# EAGLE design trackuino-shield (EAGLE 9.2.2)
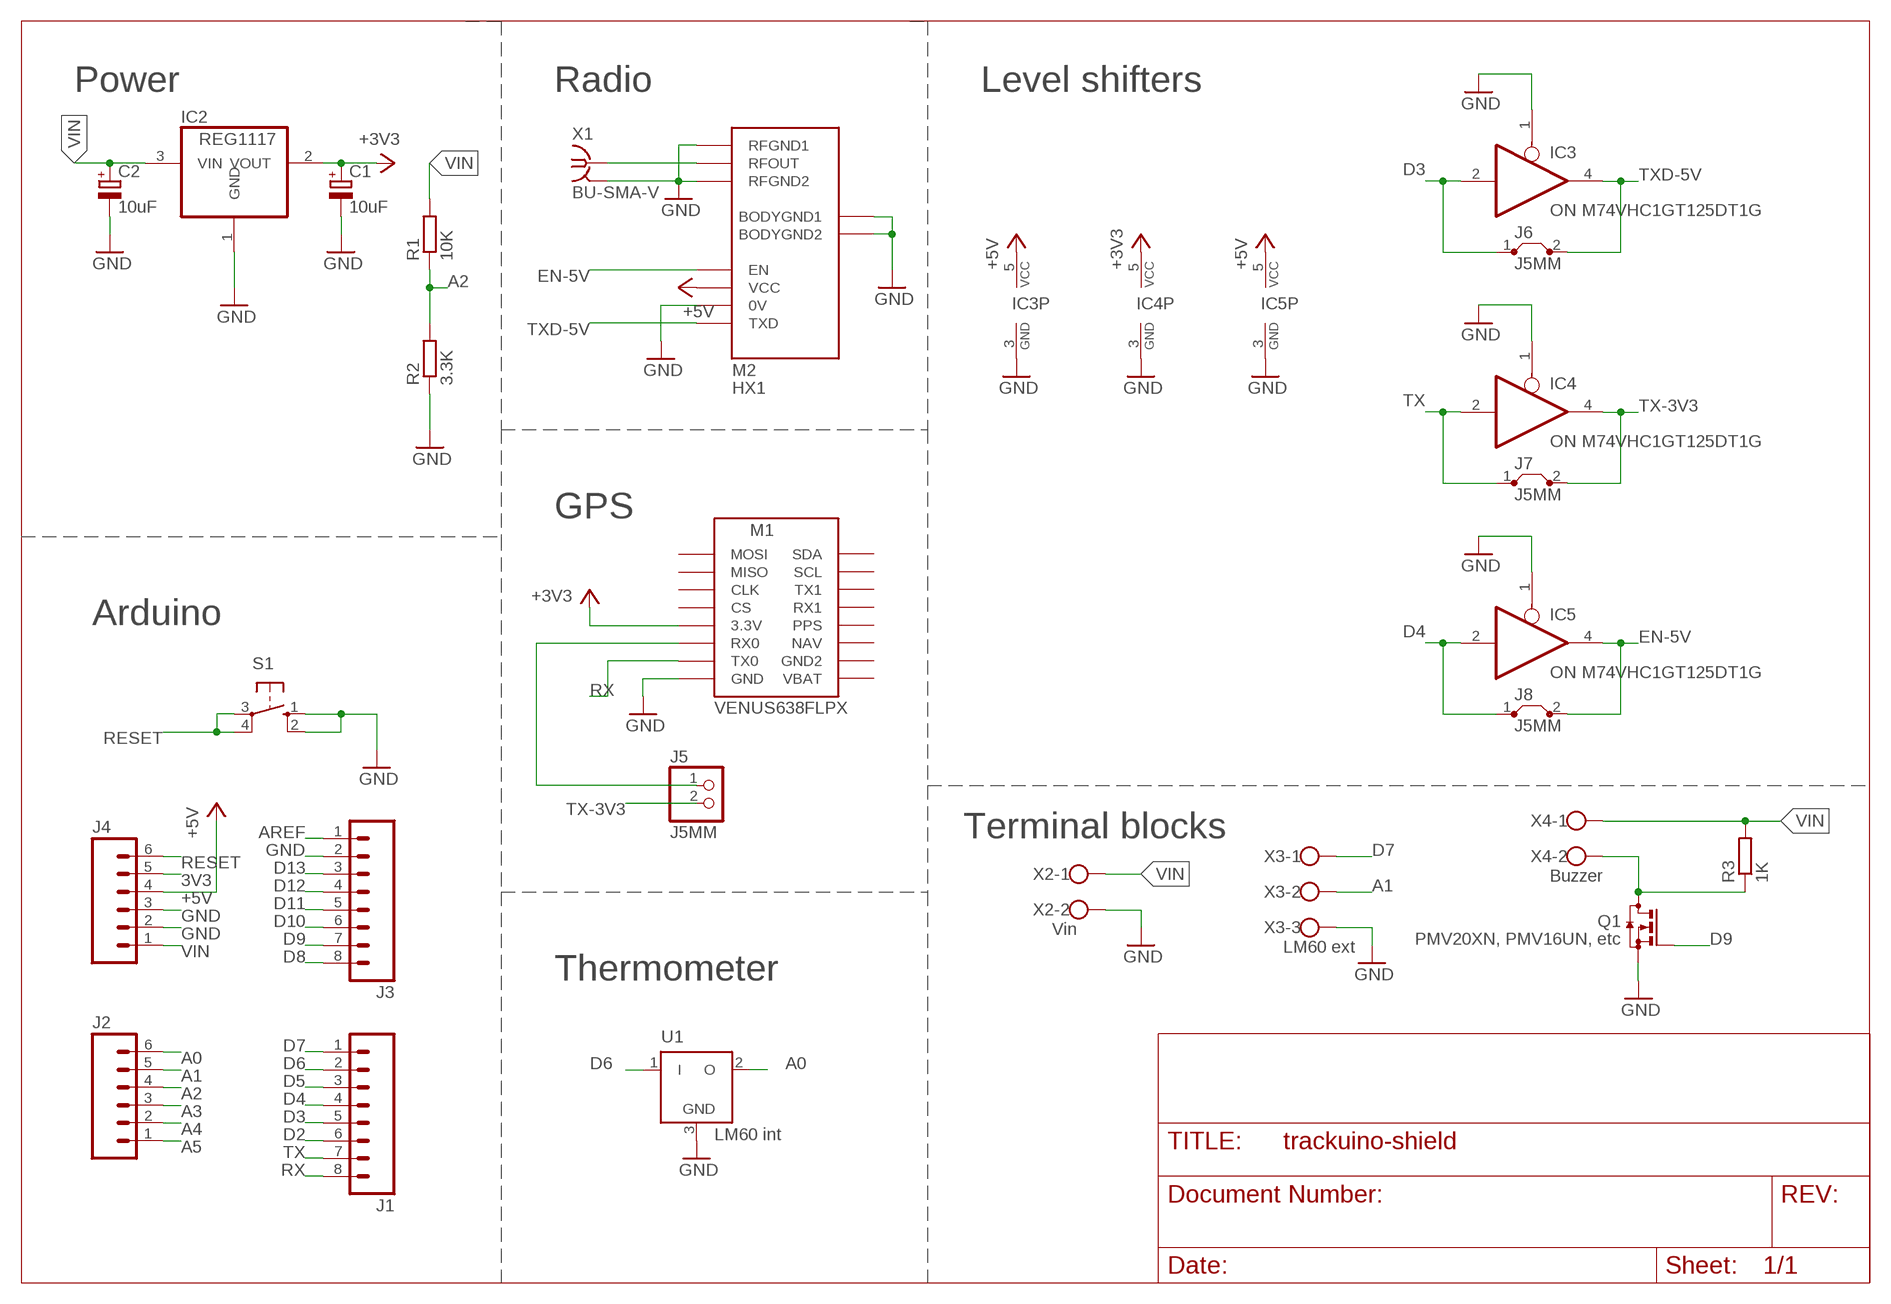
[diagram p0: schematic, sheet 1]

## Parts
C1  10uF  CPOL-EUE2.5-5  [E2,5-5]
C2  10uF  CPOL-EUE2.5-5  [E2,5-5]
IC2  REG1117  [SOT223]
IC3  ON M74VHC1GT125DT1G  74AHC1G125DBV  [SOT23-5]
IC4  ON M74VHC1GT125DT1G  74AHC1G125DBV  [SOT23-5]
IC5  ON M74VHC1GT125DT1G  74AHC1G125DBV  [SOT23-5]
J1  M08LOCK  [1X08_LOCK]
J2  M06FEMALE_LOCK  [1X06_FEMALE_LOCK.010]
J3  M08LOCK  [1X08_LOCK]
J4  M06FEMALE_LOCK  [1X06_FEMALE_LOCK.010]
J5  J5MM  PINHD-1X2  [1X02]
J6  J5MM  [05]
J7  J5MM  [05]
J8  J5MM  [05]
M1  VENUS638FLPX  [VENUS638FLPX]
M2  HX1  [HX1]
Q1  PMV20XN, PMV16UN, etc  BSS123  [SOT23]
R1  10K  R-EU_R1206  [R1206]
R2  3.3K  R-EU_R1206  [R1206]
R3  1K  R-EU_R1206  [R1206]
S1  10-XX  [B3F-10XX]
U1  LM60 int  LM60  [TO92]
X1  BU-SMA-V  [BU-SMA-V]
X2  Vin  W237-102  [W237-102]
X3  LM60 ext  W237-103  [W237-103]
X4  Buzzer  W237-102  [W237-102]

## Nets
3V3: J4.5
+3V3 [20]: C1.+ IC2.2(VOUT) IC4.5(VCC) M1.3V3(3.3V)
+5V [20]: IC3.5(VCC) IC5.5(VCC) J4.4 M2.VCC
A0: J2.6 U1.2(O)
A1: J2.5 X3.2
A2: J2.4 R1.1 R2.2
A3: J2.3
A4: J2.2
A5: J2.1
AREF: J3.1
D2: J1.6
D3: IC3.2(I) J1.5 J6.1
D4: IC5.2(I) J1.4 J8.1
D5: J1.3
D6: J1.2 U1.1(I)
D7: J1.1 X3.1
D8: J3.8
D9: J3.7 Q1.1(G)
D10: J3.6
D11: J3.5
D12: J3.4
D13: J3.3
EN-5V: IC5.4(O) J8.2 M2.EN
GND: C1.- C2.- IC2.1(GND) IC3.1(OE) IC3.3(GND) IC4.1(OE) IC4.3(GND) IC5.1(OE) IC5.3(GND) J3.2 J4.2 J4.3 M1.GND M2.0V M2.BODYGND1 M2.BODYGND2 M2.RFGND1 M2.RFGND2 Q1.2(S) R2.1 S1.1(S) S1.2(S1) U1.3(GND) X1.2(GND) X2.2 X3.3
N$1: Q1.3(D) R3.1 X4.2
N$2: J5.1 M1.RX0
RESET: J4.6 S1.3(P) S1.4(P1)
RFOUT [20]: M2.RFOUT X1.1
RX: J1.8 M1.TX0
TX: IC4.2(I) J1.7 J7.1
TX-3V3: IC4.4(O) J5.2 J7.2
TXD-5V: IC3.4(O) J6.2 M2.TXD
VIN [30]: C2.+ IC2.3(VIN) J4.1 R1.2 R3.2 X2.1 X4.1
Unconnected: M1.CLK M1.CS M1.GND2 M1.MISO M1.MOSI M1.NAV M1.PPS M1.RX1 M1.SCL M1.SDA M1.TX1 M1.VBAT

## Notes on the sheet
- Power | Radio | Level shifters
- GPS
- Arduino
- Terminal blocks
- Thermometer

## Power pins joined to a net without a drawn wire
GND: X1.3(GND) X1.4(GND) X1.5(GND)

## Library data of the parts
C1 C2 = rcl:CPOL-EU: POLARIZED CAPACITOR, European symbol
IC2 = burr-brown:REG1117: 800mA and 1A Low Dropout (LDO) Positive Regulator 1.8V, 2.5V, 2.85V, 3.3V, 5V, and Adj; MPN: REG1117; OC_FARNELL: 1097566; OC_NEWARK: 14P6981
IC3-IC5 = 74xx-little-us:74*1G125: Single Bus Buffer Gate with 3-State Output
J1 J3 = SparkFun:M08: Header 8 Standard 8-pin 0.1" header. Use with straight break away headers (SKU : PRT-00116), right angle break away headers (PRT-00553), swiss pins (PRT-00743), machine pins (PRT-00117), and female headers (PRT-00115).
J2 J4 = SparkFun:M06: Header 6 Standard 6-pin 0.1" header. Use with straight break away headers (SKU : PRT-00116), right angle break away headers (PRT-00553), swiss pins (PRT-00743), machine pins (PRT-00117), and female headers (PRT-00115). Molex polarized connector foot print use with SKU : PRT-08094 with associated crimp pins and housings. NOTES ON THE VARIANTS LOCK and LOCK_LONGPADS... This footprint was designed to help hold the alignment of a through-hole component (i.e. 6-pin header) while soldering it into place. You may notice that each hole has been shifted either up or down by 0.005 of an inch from it's more standard position (which is a perfectly straight line). This slight alteration caused the pins (the squares in the middle) to touch the edges of the holes. Because they are alternating, it causes a "brace" to hold the component in place. 0.005 has proven to be the perfect amount of "off-center" position when using our standard breakaway headers. Although looks a little odd when you look at the bare footprint, once you have a header in there, the alteration is very hard to notice. Also, if you push a header all the way into place, it is covered up entirely on the bottom side. This idea of altering the position of holes to aid alignment will be further integrated into the Sparkfun Library for other footprints. It can help hold any component with 3 or more connection pins.
J5 = pinhead:PINHD-1X2: PIN HEADER
J6-J8 = jumper:J: Bridge
M1 = Venus638FLPx:VENUS638FLPX
M2 = trackuino:HX1
Q1 = transistor-small-signal:BSS123: N-CHANNEL MOS FET
R1-R3 = resistor:R-EU_: RESISTOR, European symbol
S1 = switch-omron:10-XX: OMRON SWITCH
U1 = trackuino:LM60
X1 = con-coax:BU-SMA-V: FEMALE SMA CONNECTOR Radiall distributor RS 112-3794; OC_FARNELL: unknown; OC_NEWARK: unknown
X2 X4 = con-wago-500:W237-102: WAGO SCREW CLAMP; MPN: 237-102; OC_FARNELL: unknown; OC_NEWARK: 70K9898
X3 = con-wago-500:W237-103: WAGO SCREW CLAMP; MPN: 237-103; OC_FARNELL: unknown; OC_NEWARK: 18M7116

## Net classes
0 10: width 0.254 mm
1 15: width 0.381 mm
2 20: width 0.508 mm
3 30: width 0.762 mm
4 40: width 1.016 mm
5 50: width 1.27 mm
6 HIGH Current: width 2.54 mm

## Board
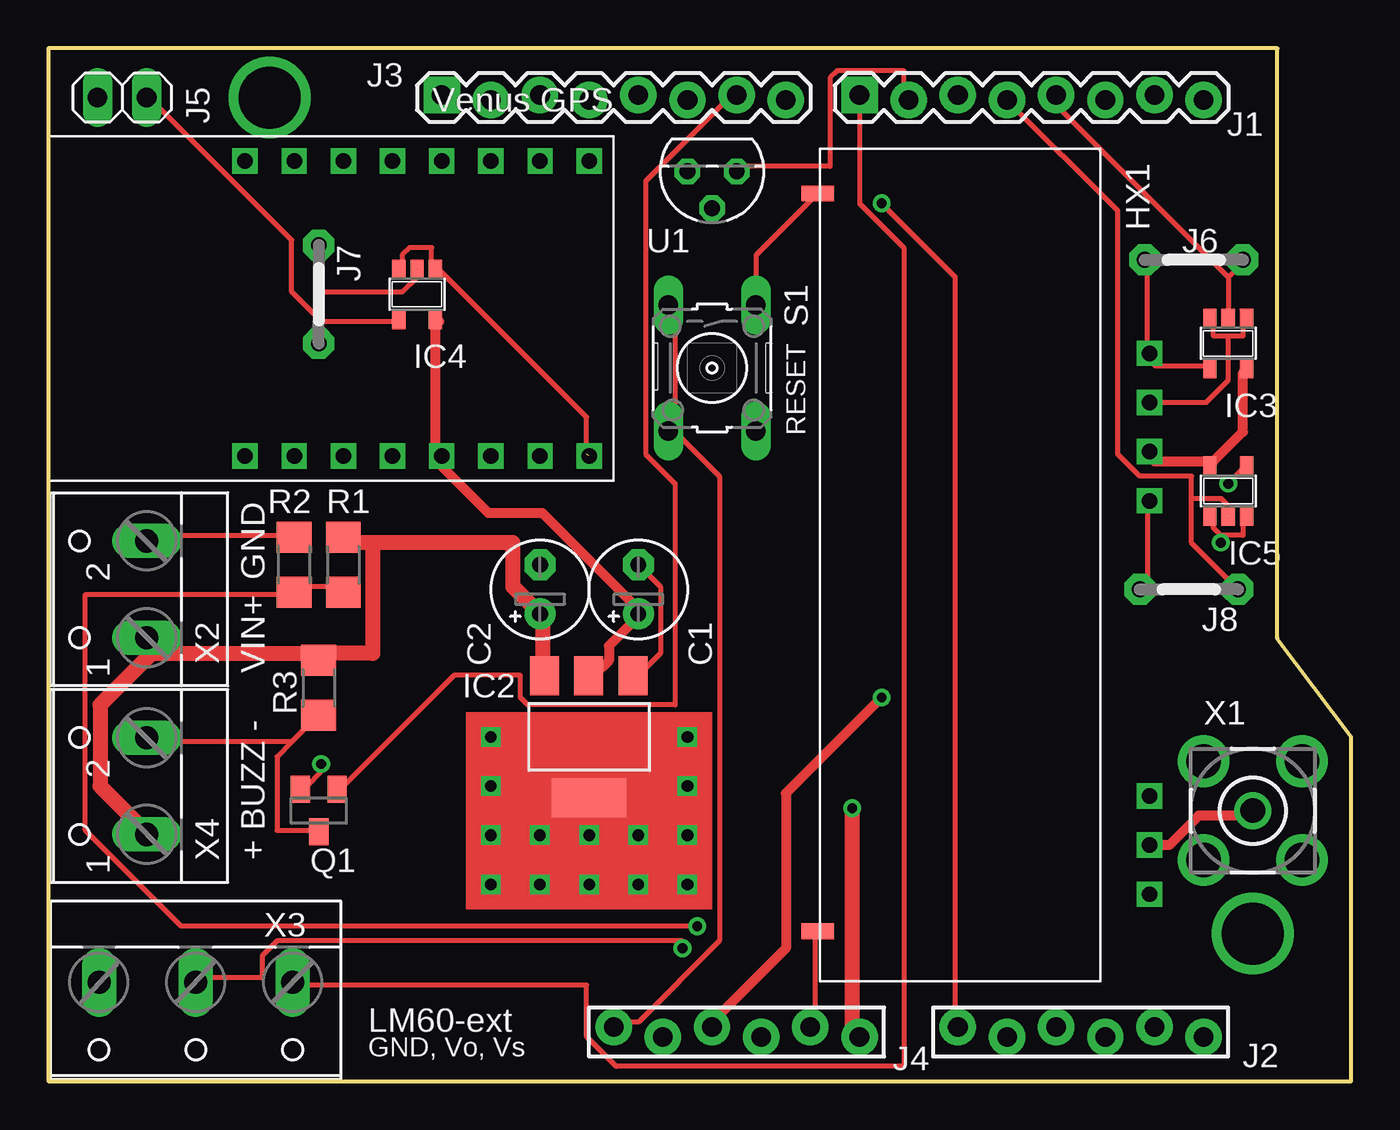
[diagram p1: board, top side]
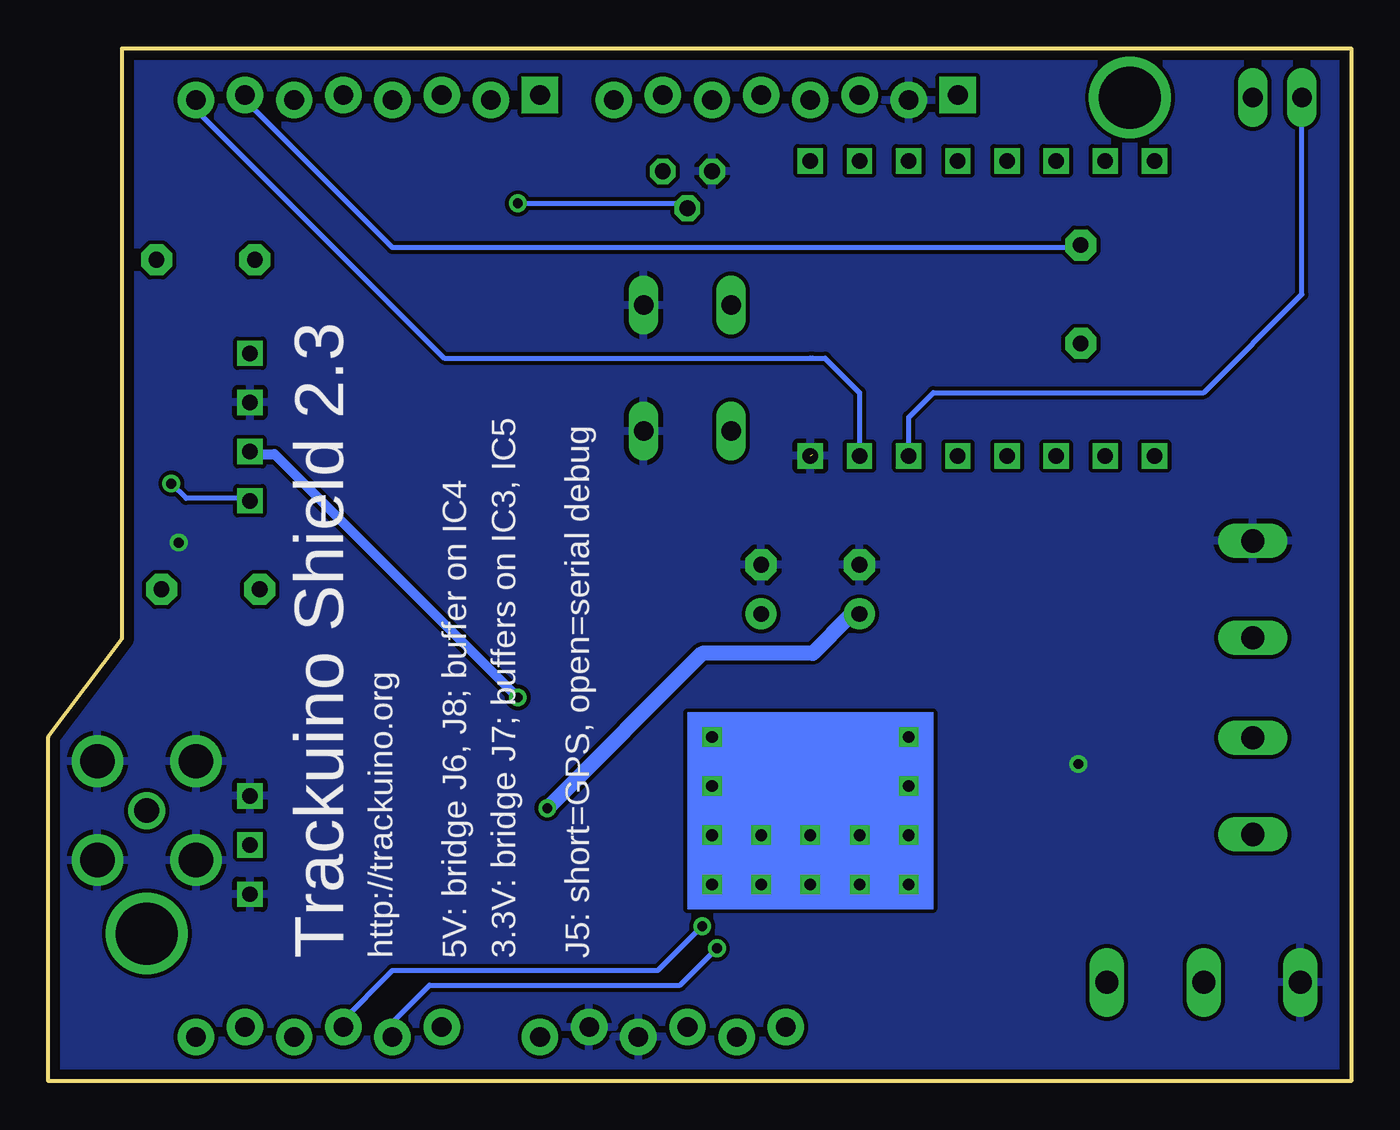
[diagram p2: board, bottom side, seen from below]

Size 67.31 x 53.34 mm. Coordinates in mm from the lower left corner, seen from the top.
Outline: 63.5,53.34 0,53.34 0,0 67.31,0 67.31,17.78 63.5,22.86 63.5,53.34
Copper layers (1*16): Top 0.035mm / dielectric 1.5mm / Bottom 0.035mm
Design rules "default": minimum track width 10mil, minimum drill 20mil, track to track 8mil, track to pad 8mil, pad to pad 8mil, via to via 8mil, smd to smd 8mil, copper to edge 20mil, drill to drill 8mil, minimum pad ring 10mil, minimum via ring 8mil, stop-mask expansion 4mil, vias tented up to drill 0mil, thermal gap 10mil

### Footprints (pad centres in the part's own frame; a part is rotated, then mirrored left to right if it is on the bottom)
E2,5-5 = drill 0.813 pad 1.6: + -1.27,0 | drill 0.813 pad 1.6 octagon: - 1.27,0
SOT223 = smd 1.499 x 2.007: 1 -2.261,-3.15; 2 0.025,-3.15; 3 2.311,-3.15 | smd 3.81 x 2.007: 4 0,3.15
SOT23-5 = smd 0.69 x 0.99: 1 -0.95,-1.29; 2 0,-1.29; 3 0.95,-1.29; 4 0.95,1.3; 5 -0.95,1.3
1X08_LOCK = drill 1.016 pad 1.88 square: 1 0,0.127 | drill 1.016 pad 1.88: 2 2.54,-0.127; 3 5.08,0.127; 4 7.62,-0.127; 5 10.16,0.127; 6 12.7,-0.127; 7 15.24,0.127; 8 17.78,-0.127
1X06_FEMALE_LOCK.010 = drill 1.016 pad 1.88: 1 0,0.254; 2 2.54,-0.254; 3 5.08,0.254; 4 7.62,-0.254; 5 10.16,0.254; 6 12.7,-0.254
1X02 = drill 1.016 long: 1 -1.27,0; 2 1.27,0
05 = drill 0.813 pad 1.6 octagon: 1 -2.54,0; 2 2.54,0
VENUS638FLPX = drill 0.8 square: 3V3 8.89,16.51; CLK 13.97,16.51; CS 11.43,16.51; GND 1.27,16.51; GND2 3.81,1.27; MISO 16.51,16.51; MOSI 19.05,16.51; NAV 6.35,1.27; PPS 8.89,1.27; RX0 6.35,16.51; RX1 11.43,1.27; SCL 16.51,1.27; SDA 19.05,1.27; TX0 3.81,16.51; TX1 13.97,1.27; VBAT 1.27,1.27
HX1 = drill 0.8 square: 0V 25.4,-8.89; EN 20.32,-8.89; RFGND1 0,-8.89; RFGND2 5.08,-8.89; RFOUT 2.54,-8.89; TXD 27.94,-8.89; VCC 22.86,-8.89 | smd 0.813 x 1.676: BODYGND1 -1.905,8.255; BODYGND2 36.195,8.255
SOT23 = smd 1 x 1.4: 1 -0.95,-1.1; 2 0.95,-1.1; 3 0,1.1
R1206 = smd 1.6 x 1.803: 1 -1.422,0; 2 1.422,0
B3F-10XX = drill 1.016 long: 1 -3.251,2.261; 2 3.251,2.261; 3 -3.251,-2.261; 4 3.251,-2.261
TO92 = drill 0.813 octagon: 1 -1.27,0; 2 0,1.905; 3 1.27,0
BU-SMA-V = drill 1.27: 1 0,0 | drill 1.778: 2 -2.55,2.55; 3 2.55,2.55; 4 2.55,-2.55; 5 -2.55,-2.55
W237-102 = drill 1.194 long: 1 -2.5,-1.27; 2 2.5,-1.27
W237-103 = drill 1.194 long: 1 -5,-1.29; 2 0,-1.29; 3 5,-1.29

### Placement (x,y rotation side)
C1  30.48,25.4 90 top
C2  25.4,25.4 90 top
IC2  27.94,17.78 180 top
IC3  60.96,38.1 180 top
IC4  19.05,40.64 180 top
IC5  60.96,30.48 0 top
J1  41.91,50.8 0 top
J2  59.69,2.54 180 top
J3  20.32,50.8 0 top
J4  41.91,2.54 180 top
J5  3.81,50.8 0 top
J6  59.18,42.42 180 top
J7  13.97,40.64 270 top
J8  58.93,25.4 180 top
M1  29.21,48.8 180 top
M2  48.01,9.65 90 top
Q1  13.97,13.97 180 top
R1  15.24,26.67 90 top
R2  12.7,26.67 270 top
R3  13.97,20.32 90 top
S1  34.29,36.83 270 top
U1  34.29,46.99 180 top
X1  62.23,13.97 0 top
X2  3.81,25.4 90 top
X3  7.62,3.81 180 top
X4  3.81,15.24 90 top

### Tracks (layer width: path | path; a pad name or v marks a point on that pad's centre or on a via)
+3V3
  Top 0.508: IC2.2 28.19,20.95 28.96,21.72 28.96,22.48 30.48,24 C1.+ 30.48,24.38 25.53,29.34 22.73,29.34 20.32,31.75 M1.3V3 20,32.61 IC4.5 20.19,39.24
+5V  (via drill 0.51)
  Top 0.508: M2.VCC 57.15,32.38 57.15,32 59.82,32 IC5.5 60.2,32 61.72,33.53 61.72,36.58 IC3.5 | v43.05,19.81 38.1,14.86 38.1,6.86 34.29,3.05 J4.4
  Bottom 0.508: v43.05,19.81 55.63,32.38 56.77,32.38 M2.VCC
A0  (via drill 0.51)
  Top 0.254: v43.05,45.34 46.86,41.53 46.86,3.05 J2.6
  Bottom 0.254: v43.05,45.34 34.29,45.34 U1.2
A1  (via drill 0.51)
  Top 0.254: v32.77,6.86 32.77,7.24 11.81,7.24 11.05,6.48 11.05,5.33 7.62,5.33 X3.2
  Bottom 0.254: v32.77,6.86 34.67,4.95 47.62,4.95 49.53,3.05 J2.5
A2  (via drill 0.51)
  Top 0.254: R1.1 15.24,25.53 12.95,25.53 R2.2 12.57,25.15 1.91,25.15 1.91,12.95 6.86,8 v33.53,8
  Bottom 0.254: v33.53,8 35.81,5.71 49.53,5.71 52.2,3.05 J2.4
D3
  Top 0.254: 60.96,41.53 IC3.2 | 60.96,41.53 61.72,42.29 J6.1 | 60.96,41.53 52.2,50.29 52.2,50.67 J1.5
D4
  Top 0.254: IC5.2 60.96,29.72 60.58,30.1 59.05,30.1 | 59.05,30.1 59.05,27.81 J8.1 | J1.4 55.24,44.96 55.24,32.38 56.39,31.24 59.05,31.24 59.05,30.1
D6
  Top 0.254: U1.1 35.81,47.24 40.39,47.24 40.39,51.82 40.77,52.2 44.2,52.2 44.2,50.67 J1.2
D7
  Top 0.254: J1.1 41.91,45.34 44.2,43.05 44.2,0.76 29.34,0.76 27.81,2.29 27.81,4.95 12.95,4.95 X3.1
D9
  Top 0.254: Q1.1 15.24,15.24 20.95,20.95 24.38,20.95 24.38,19.81 24.77,19.43 32.38,19.43 32.38,30.86 30.86,32.38 30.86,46.48 35.43,51.05 J3.7
EN-5V  (via drill 0.51)
  Top 0.254: v60.96,30.86 61.72,31.62 IC5.4 | J8.2 56.39,25.53 56.77,25.91 56.77,29.72 M2.EN
  Bottom 0.254: v60.96,30.86 60.2,30.1 57.15,30.1 M2.EN
GND  (via drill 0.51)  (1 unrouted)
  Top 0.254: IC4.3 18.29,42.29 18.29,42.67 18.67,43.05 19.81,43.05 19.81,42.29 IC4.1 20.19,41.91 27.81,34.29 27.81,32.38 | 60.58,28.19 60.2,28.57 60.2,28.96 IC5.1 | 60.58,28.19 61.72,28.19 61.72,28.96 IC5.3 | 60.96,38.48 61.72,38.48 61.72,39.24 IC3.1 | 60.96,38.48 60.2,38.48 60.2,39.24 IC3.3 | v14.1,16.38 14.1,16 13.34,15.24 Q1.2 | M2.BODYGND1 39.62,7.62 39.62,3.05 J4.2 | M2.BODYGND2 36.58,42.67 36.58,40.39 S1.1 | 60.96,38.48 60.96,36.2 59.82,35.05 M2.0V | v60.58,27.81 60.58,28.19 | R2.1 12.57,28.19 5.33,28.19 X2.2 | C1.- 31.62,25.53 31.62,22.1 30.48,20.95 IC2.1
  pour Bottom: 0,53.34 63.5,53.34 63.5,22.86 67.31,17.78 67.31,0 0,0
N$1
  Top 0.254: 12.57,17.53 13.72,18.67 R3.1 | 12.57,17.53 11.81,16.76 11.81,12.95 13.72,12.95 Q1.3 | 12.57,17.53 5.33,17.53 X4.2
N$2
  Bottom 0.254: M1.RX0 22.86,34.29 21.59,35.56 7.62,35.56 2.54,40.64 J5.1
N$3  (via drill 3.2)
  other vias: 62.23,7.62
N$4  (via drill 3.2)
  other vias: 11.43,50.8
N$5  (via drill 0.6)
  other vias: 22.86,17.78
N$6  (via drill 0.6)
  other vias: 22.86,15.24
N$7  (via drill 0.6)
  other vias: 22.86,12.7
N$8  (via drill 0.6)
  other vias: 22.86,10.16
N$9  (via drill 0.6)
  other vias: 25.4,10.16
N$10  (via drill 0.6)
  other vias: 27.94,10.16
N$11  (via drill 0.6)
  other vias: 30.48,10.16
N$12  (via drill 0.6)
  other vias: 33.02,10.16
N$13  (via drill 0.6)
  other vias: 33.02,12.7
N$14  (via drill 0.6)
  other vias: 33.02,15.24
N$15  (via drill 0.6)
  other vias: 33.02,17.78
N$16  (via drill 0.6)
  other vias: 25.4,12.7
N$17  (via drill 0.6)
  other vias: 30.48,12.7
N$18  (via drill 0.6)
  other vias: 27.94,12.7
RESET
  Top 0.254: S1.3 32.38,40.01 32.38,33.91 S1.4 32.38,33.53 34.67,31.24 34.67,7.24 30.48,3.05 29.34,3.05 J4.6
RFOUT
  Top 0.508: M2.RFOUT 57.91,12.19 59.44,13.72 62.1,13.72 X1.1
RX
  Bottom 0.254: J1.8 59.44,50.67 59.44,49.91 46.86,37.34 27.94,37.34 27.81,37.34 27.18,37.34 25.4,35.56 M1.TX0
TX
  Top 0.254: IC4.2 19.05,41.53 18.29,40.77 14.1,40.77 14.1,43.05 J7.1
  Bottom 0.254: J1.7 57.15,50.67 49.53,43.05 14.1,43.05 J7.1
TX-3V3
  Top 0.254: 14.1,39.24 17.91,39.24 IC4.4 | 14.1,39.24 14.1,38.1 J7.2 | 14.1,39.24 12.57,40.77 12.57,43.43 5.33,50.67 J5.2
TXD-5V
  Top 0.254: IC3.4 59.82,36.96 57.15,36.96 57.15,37.34 M2.TXD 56.77,37.72 56.77,42.29 J6.2
VIN  (via drill 0.51)
  Top 0.762: 5.33,22.1 13.72,22.1 R3.2 14.1,22.1 16.76,22.1 16.76,27.81 | 5.33,22.1 5.33,22.86 X2.1 5.33,22.1 | 5.33,22.1 2.67,19.43 2.67,15.24 4.95,12.95 X4.1 | 16.76,27.81 24,27.81 24,25.53 C2.+ 25.53,24 25.53,20.95 IC2.3 | 16.76,27.81 15.24,27.81 R1.2 | J4.1 41.53,2.67 v41.53,14.1
  Bottom 0.762: v41.53,14.1 33.53,22.1 27.81,22.1 25.91,24 25.53,24 C2.+
(copper drawn outside any net)
  shapes: Bottom area x1, Top area x1

### Text on the board
tNames: RESET | GND | VIN+ | + BUZZ - | LM60-ext | GND, Vo, Vs
bNames: J5: short=GPS, open=serial debug | 3.3V: bridge J7; buffers on IC3, IC5 | 5V: bridge J6, J8; buffer on IC4 | http://trackuino.org | Trackuino Shield 2.3